# Altium schematic sheet Power.SchDoc: BMS Link Power
size A4; Organization: SFU Team Phantom; SheetNumber: 2; SheetTotal: 3
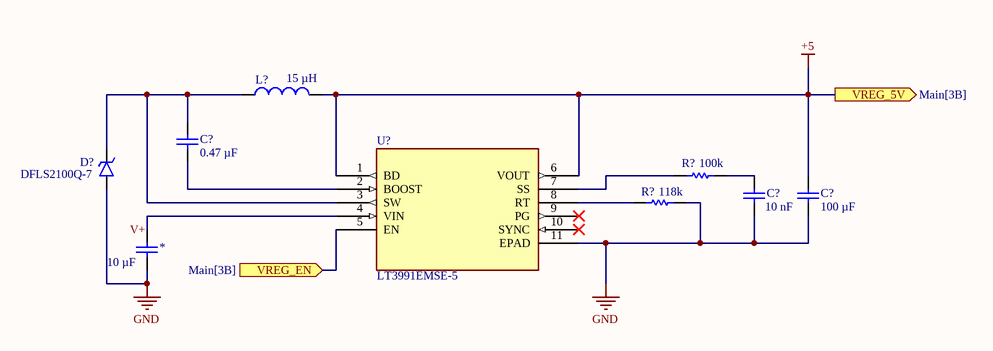
[diagram p0: Power.SchDoc]

## Parts
(Parts that share a designator on the sheet are numbered #1, #2 ... from top to bottom, then left to right.)
*  value 10 µF  [1210_CAPACITOR]  (hidden comment: CL32B106KMVNNWE)
C?#1  value 0.47 µF  [0805_CAPACITOR]  (hidden comment: CC0805JKX7R9BB474)
C?#2  value 10 nF  [0805_CAPACITOR]  (hidden comment: CL21B103KBANNNC)
C?#3  value 100 µF  [WCAP-ASLI_6.3X5.5(DXL)]  (hidden comment: 865080343009)
D?  DFLS2100Q-7  [POWERDI123_DIO_ABR-M]
L?  value 15 µH  [IND_VLS6045EX-150M]  (hidden comment: VLS6045EX-150M)
R?#1  value 100k  [0805_RESISTOR]  (hidden comment: ERJ-6ENF1003V)
R?#2  value 118k  [0805_RESISTOR]  (hidden comment: ERA6AEB1183V)
U?  LT3991EMSE-5  [MSOP-10_MSE]

## Ports
VREG_5V (out, see Main[3B]), VREG_EN (in, see Main[3B])

## Nets
+5: C?#3.1 L?.2 U?.1(BD) U?.6(VOUT) ; port VREG_5V
GND: *.2 C?#2.2 C?#3.2 D?.1(A) R?#2.2 U?.11(EPAD)
V+: *.1 U?.4(VIN)
VREG_EN: U?.5(EN) ; port VREG_EN
NetC?#1_1: C?#1.1 D?.2(K) L?.1 U?.3(SW)
NetC?#1_2: C?#1.2 U?.2(BOOST)
NetC?#2_1: C?#2.1 R?#1.2
NetR?#1_1: R?#1.1 U?.7(SS)
NetR?#2_1: R?#2.1 U?.8(RT)

Not connected (* = marked no-connect by the designer): U? 9(PG)* 10(SYNC)*

## Library data of the parts
* = CL32B106KMVNNWE: 10 µF ±10% 63V Ceramic Capacitor X7R 1210 (3225 Metric)
C?#1 = CC0805JKX7R9BB474: 0.47 µF ±5% 50V Ceramic Capacitor X7R 0805 (2012 Metric)
C?#2 = CL21B103KBANNNC: 10 nF ±10% 50V Ceramic Capacitor X7R 0805 (2012 Metric)
C?#3 = 865080343009: 100 µF 16 V Aluminum Electrolytic Capacitors Radial, Can - SMD 2000 Hrs @ 105°C
D? = DFLS2100Q-7: Diode 100 V 2A Surface Mount PowerDI™ 123; Manufacturer_Name: Diodes Inc; Copyright: Copyright (C) 2025 Ultra Librarian. All rights reserved.; Manufacturer_Part_Number: DFLS2100Q-7
L? = VLS6045EX-150M: 15 µH Shielded Drum Core, Wirewound Inductor 2.5 A 75mOhm Nonstandard
R?#1 = ERJ-6ENF1003V: 100 kOhms ±1% 0.125W, 1/8W Chip Resistor 0805 (2012 Metric) Automotive AEC-Q200 Thick Film
R?#2 = ERA6AEB1183V: 118 kOhms ±0.1% 0.125W, 1/8W Chip Resistor 0805 (2012 Metric) Automotive AEC-Q200 Thin Film; MP: ERA6AEB1183V; Package: None; Availability: Unavailable; Price: None
U? = LT3991EMSE-5: 55V, 1.2A Step-Down Regulator with 2.8 uA Quiescent Current; MF: Analog Devices; MP: LT3991EMSE-5#PBF; Value: *; Package: MSOP -10 Analog Devices; Digi-Key_Part_Number: LT3991EMSE-5#PBF-ND; Check_prices: https://www.snapeda.com/parts/LT3991EMSE-5%23PBF/Analog+Devices/view-part/?ref=eda; SnapEDA_Link: https://www.snapeda.com/parts/LT3991EMSE-5%23PBF/Analog+Devices/view-part/?ref=snap; Purchase-URL: https://pricing.snapeda.com/search/part/LT3991EMSE-5#PBF/?ref=eda